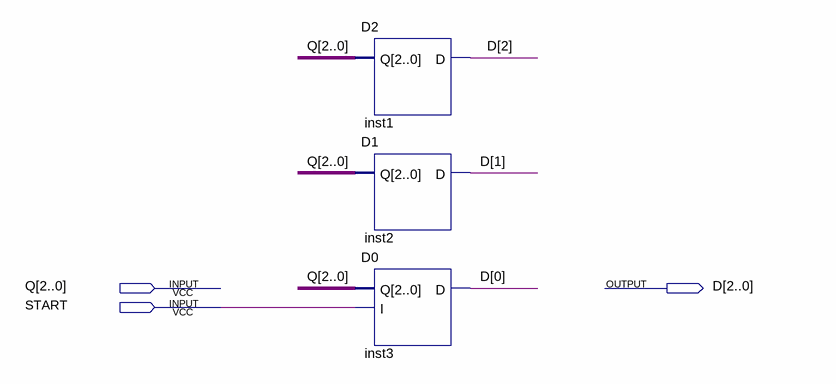
[diagram p0: schematic sheet]
// Quartus schematic NEXT_STATE.bdf as structural Verilog: 3 symbols, 3 pins
module NEXT_STATE (
  input  [2:0] Q,
  input  START,
  output [2:0] D
);

  D2 inst1 (.Q(Q), .D(D[2]));
  D1 inst2 (.Q(Q), .D(D[1]));
  D0 inst3 (.Q(Q), .I(START), .D(D[0]));
endmodule
